# Altium project S25-Packaging.PrjPcb
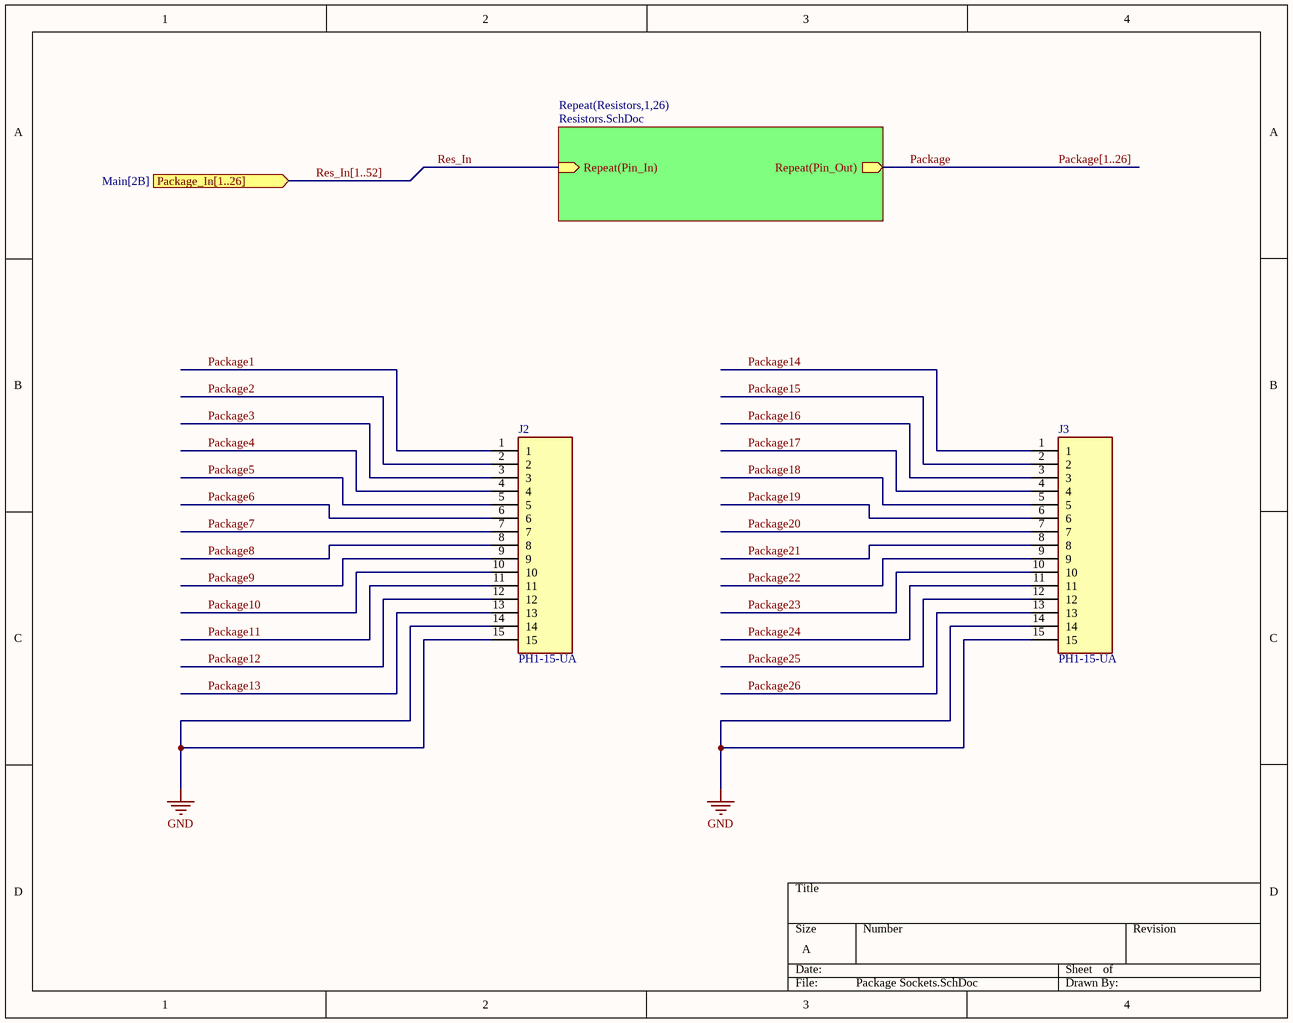
[diagram p0: Package Sockets.SchDoc]
1 sheet, 2 parts. Net scope: hierarchical (ports join the sheet entries above them; power ports are global).

## Sheet Package Sockets.SchDoc
size A; SheetNumber: 3; SheetTotal: 5

### Parts
J2  PH1-15-UA  [HDRV15W64P0X254_1X15_3810X249X886P]
J3  PH1-15-UA  [HDRV15W64P0X254_1X15_3810X249X886P]

### Sub-sheets
Repeat(Resistors,1,26) = Resistors.SchDoc (file not in this document): Repeat(Pin_In) (in), Repeat(Pin_Out) (out)

### Ports
Package_In[1..26] (in, see Main[2B])

### Nets
GND: J2.14 J2.15 J3.14 J3.15
Package: sheet Repeat(Resistors,1,26)/Repeat(Pin_Out)
Package1: J2.1
Package2: J2.2
Package3: J2.3
Package4: J2.4
Package5: J2.5
Package6: J2.6
Package7: J2.7
Package8: J2.8
Package9: J2.9
Package10: J2.10
Package11: J2.11
Package12: J2.12
Package13: J2.13
Package14: J3.1
Package15: J3.2
Package16: J3.3
Package17: J3.4
Package18: J3.5
Package19: J3.6
Package20: J3.7
Package21: J3.8
Package22: J3.9
Package23: J3.10
Package24: J3.11
Package25: J3.12
Package26: J3.13
Res_In: sheet Repeat(Resistors,1,26)/Repeat(Pin_In)

### Buses and harness runs
bus Package[1..26]
bus Res_In[1..52] = port Package_In[1..26]

### Library data of the parts
J2 J3 = PH1-15-UA: Connector; Manufacturer_Name: Adam Tech; Datasheet Link: https://app.adam-tech.com/products/download/data_sheet/201605/ph1-xx-ua-data-sheet.pdf; Height: 8.865mm; Manufacturer_Part_Number: PH1-15-UA; Mouser Part Number: 737-PH1-15-UA; Mouser Price/Stock: https://www.mouser.co.uk/ProductDetail/Adam-Tech/PH1-15-UA?qs=HoCaDK9Nz5dUS47ZXPBTBg%3D%3D; Arrow Part Number: PH1-15-UA; Arrow Price/Stock: https://www.arrow.com/en/products/ph1-15-ua/adam-tech?region=nac